# EAGLE design Side 2 (EAGLE 8.5.1)
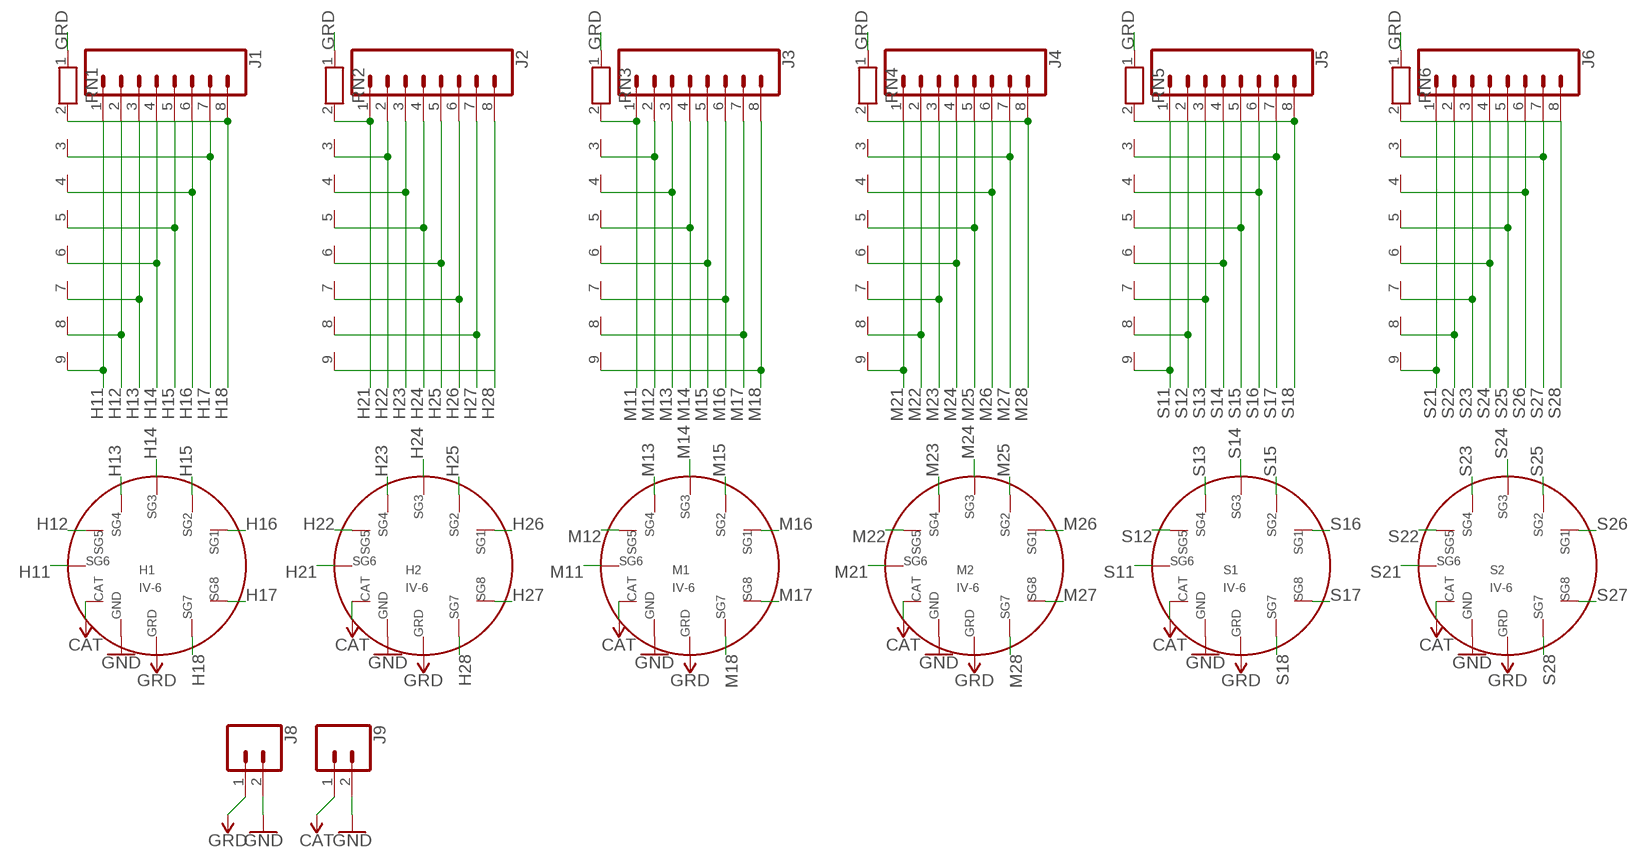
[diagram p0: schematic, sheet 1]

## Parts
H1  IV-6  [IV-6]
H2  IV-6  [IV-6]
J1  CONN_08"  [1X08]
J2  CONN_08"  [1X08]
J3  CONN_08"  [1X08]
J4  CONN_08"  [1X08]
J5  CONN_08"  [1X08]
J6  CONN_08"  [1X08]
J8  CONN_02  [1X02]
J9  CONN_02  [1X02]
M1  IV-6  [IV-6]
M2  IV-6  [IV-6]
RN1  RN08  [RN-9]
RN2  RN08  [RN-9]
RN3  RN08  [RN-9]
RN4  RN08  [RN-9]
RN5  RN08  [RN-9]
RN6  RN08  [RN-9]
S1  IV-6  [IV-6]
S2  IV-6  [IV-6]

## Nets
CAT: H1.CAT H2.CAT J9.1 M1.CAT M2.CAT S1.CAT S2.CAT
GND: H1.GND H2.GND J8.2 J9.2 M1.GND M2.GND S1.GND S2.GND
GRD: H1.GRD H2.GRD J8.1 M1.GRD M2.GRD RN1.1 RN2.1 RN3.1 RN4.1 RN5.1 RN6.1 S1.GRD S2.GRD
H11: H1.SG6 J1.1 RN1.9
H12: H1.SG5 J1.2 RN1.8
H13: H1.SG4 J1.3 RN1.7
H14: H1.SG3 J1.4 RN1.6
H15: H1.SG2 J1.5 RN1.5
H16: H1.SG1 J1.6 RN1.4
H17: H1.SG8 J1.7 RN1.3
H18: H1.SG7 J1.8 RN1.2
H21: H2.SG6 J2.1 RN2.2
H22: H2.SG5 J2.2 RN2.3
H23: H2.SG4 J2.3 RN2.4
H24: H2.SG3 J2.4 RN2.5
H25: H2.SG2 J2.5 RN2.6
H26: H2.SG1 J2.6 RN2.7
H27: H2.SG8 J2.7 RN2.8
H28: H2.SG7 J2.8 RN2.9
M11: J3.1 M1.SG6 RN3.2
M12: J3.2 M1.SG5 RN3.3
M13: J3.3 M1.SG4 RN3.4
M14: J3.4 M1.SG3 RN3.5
M15: J3.5 M1.SG2 RN3.6
M16: J3.6 M1.SG1 RN3.7
M17: J3.7 M1.SG8 RN3.8
M18: J3.8 M1.SG7 RN3.9
M21: J4.1 M2.SG6 RN4.9
M22: J4.2 M2.SG5 RN4.8
M23: J4.3 M2.SG4 RN4.7
M24: J4.4 M2.SG3 RN4.6
M25: J4.5 M2.SG2 RN4.5
M26: J4.6 M2.SG1 RN4.4
M27: J4.7 M2.SG8 RN4.3
M28: J4.8 M2.SG7 RN4.2
S11: J5.1 RN5.9 S1.SG6
S12: J5.2 RN5.8 S1.SG5
S13: J5.3 RN5.7 S1.SG4
S14: J5.4 RN5.6 S1.SG3
S15: J5.5 RN5.5 S1.SG2
S16: J5.6 RN5.4 S1.SG1
S17: J5.7 RN5.3 S1.SG8
S18: J5.8 RN5.2 S1.SG7
S21: J6.1 RN6.9 S2.SG6
S22: J6.2 RN6.8 S2.SG5
S23: J6.3 RN6.7 S2.SG4
S24: J6.4 RN6.6 S2.SG3
S25: J6.5 RN6.5 S2.SG2
S26: J6.6 RN6.4 S2.SG1
S27: J6.7 RN6.3 S2.SG8
S28: J6.8 RN6.2 S2.SG7

## Library data of the parts
H1 H2 M1 M2 S1 S2 = Clock components:IV-6
J1-J6 = SparkFun-Connectors:CONN_08: Multi connection point. Often used as Generic Header-pin footprint for 0.1 inch spaced/style header connections On any of the 0.1 inch spaced packages, you can populate with these: Break Away Headers - Straight <https://www.sparkfun.com/products/116> (PRT-00116) Break Away Male Headers - Right Angle <https://www.sparkfun.com/products/553> (PRT-00553) Female Headers <https://www.sparkfun.com/products/115> (PRT-00115) Break Away Headers - Machine Pin <https://www.sparkfun.com/products/117> (PRT-00117) Break Away Female Headers - Swiss Machine Pin <https://www.sparkfun.com/products/743> (PRT-00743) Arduino Stackable Header - 8 Pin <https://www.sparkfun.com/products/9279> (PRT-09279) For SCREWTERMINALS and SPRING TERMINALS visit here: Screw Terimnals on SparkFun.com <https://www.sparkfun.com/search/results?term=Screw+Terminals> (5mm/3.5mm/2.54mm spacing) This device is also useful as a general connection point to wire up your design to another part of your project. Our various solder wires solder well into these plated through hole pads. Hook-Up Wire - Assortment (Stranded, 22 AWG) <https://www.sparkfun.com/products/11375> (PRT-11375) Hook-Up Wire - Assortment (Solid Core, 22 AWG) <https://www.sparkfun.com/products/11367> (PRT-11367) View the entire wire category on our website here <https://www.sparkfun.com/categories/141> Special notes: Molex polarized connector foot print use with SKU : PRT-08231 with associated crimp pins and housings. 1MM SMD Version SKU: PRT-10208 NOTES ON THE VARIANTS LOCK and LOCK_LONGPADS... This footprint was designed to help hold the alignment of a through-hole component (i.e. 6-pin header) while soldering it into place. You may notice that each hole has been shifted either up or down by 0.005 of an inch from it's more standard position (which is a perfectly straight line). This slight alteration caused the pins (the squares in the middle) to touch the edges of the holes. Because they are alternating, it causes a "brace" to hold the component in place. 0.005 has proven to be the perfect amount of "off-center" position when using our standard breakaway headers. Although looks a little odd when you look at the bare footprint, once you have a header in there, the alteration is very hard to notice. Also,if you push a header all the way into place, it is covered up entirely on the bottom side.; PROD_ID: CONN-08438
J8 J9 = SparkFun-Connectors:CONN_02: Multi connection point. Often used as Generic Header-pin footprint for 0.1 inch spaced/style header connections On any of the 0.1 inch spaced packages, you can populate with these: Break Away Headers - Straight <https://www.sparkfun.com/products/116> (PRT-00116) Break Away Male Headers - Right Angle <https://www.sparkfun.com/products/553> (PRT-00553) Female Headers <https://www.sparkfun.com/products/115> (PRT-00115) Break Away Headers - Machine Pin <https://www.sparkfun.com/products/117> (PRT-00117) Break Away Female Headers - Swiss Machine Pin <https://www.sparkfun.com/products/743> (PRT-00743) For SCREWTERMINALS and SPRING TERMINALS visit here: Screw Terimnals on SparkFun.com <https://www.sparkfun.com/search/results?term=Screw+Terminals> (5mm/3.5mm/2.54mm spacing) This device is also useful as a general connection point to wire up your design to another part of your project. Our various solder wires solder well into these plated through hole pads. Hook-Up Wire - Assortment (Stranded, 22 AWG) <https://www.sparkfun.com/products/11375> (PRT-11375) Hook-Up Wire - Assortment (Solid Core, 22 AWG) <https://www.sparkfun.com/products/11367> (PRT-11367) View the entire wire category on our website here <https://www.sparkfun.com/categories/141> Special notes: Molex polarized connector foot print use with: PRT-08233 with associated crimp pins and housings. 2.54_SCREWTERM for use with PRT-10571. 3.5mm Screw Terminal footprints for PRT-08084 5mm Screw Terminal footprints for use with PRT-08432
RN1-RN6 = resistor-net:RN08: RESISTOR NETWORK; OC_FARNELL: unknown; OC_NEWARK: unknown

## Board
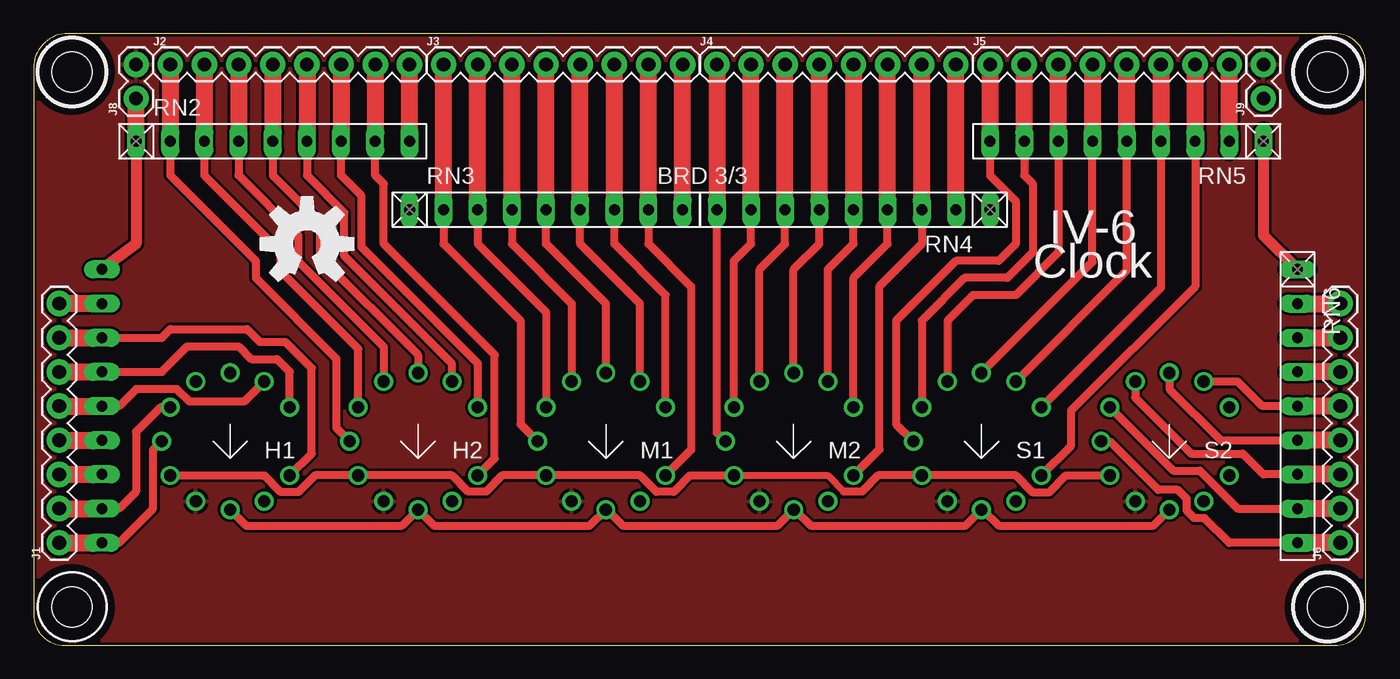
[diagram p1: board, top side]
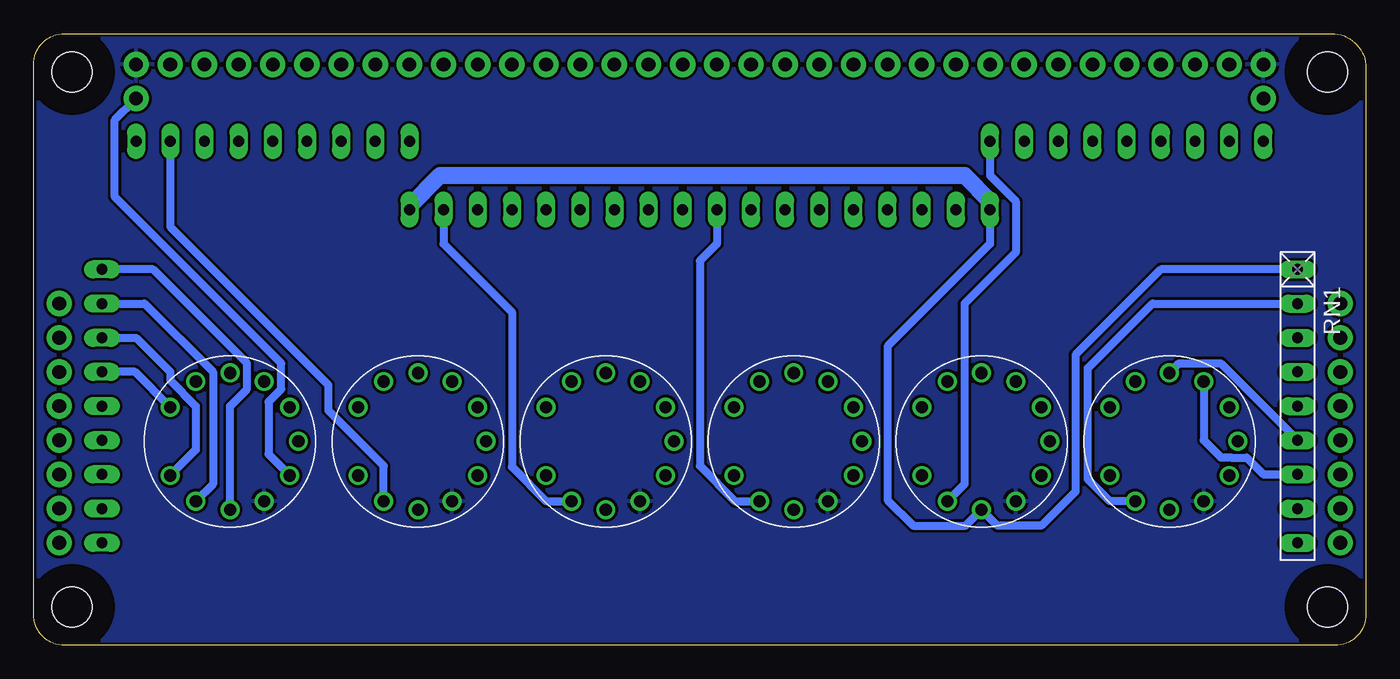
[diagram p2: board, bottom side, seen from below]

Size 99.06 x 45.47 mm. Coordinates in mm from the lower left corner, seen from the top.
Outline: 0,42.93 0,2.29 arc90 2.29,0 96.77,0 arc90 99.06,2.29 99.06,43.18 arc90 96.77,45.47 2.54,45.47 arc90 0,42.93
Copper layers (1*16): Top 0.035mm / dielectric 1.5mm / Bottom 0.035mm
Design rules "default *": minimum track width 6mil, minimum drill 0.35mm, track to track 8mil, track to pad 8mil, pad to pad 8mil, via to via 8mil, smd to smd 8mil, copper to edge 8mil, drill to drill 8mil, minimum pad ring 10mil, minimum via ring 8mil, stop-mask expansion 4mil, vias tented up to drill 0mil, thermal gap 10mil
Holes 3 mm at 2.86,42.61 96.2,42.61 96.2,2.86 2.86,2.86
tRestrict: area 1,1 to 4.8,4.8; area 1,40.7 to 4.8,44.5; area 94.3,40.7 to 98.1,44.5; area 94.3,1 to 98.1,4.8
bRestrict: area 1,1 to 4.8,4.8; area 1,40.7 to 4.8,44.5; area 94.3,40.7 to 98.1,44.5; area 94.3,1 to 98.1,4.8

### Footprints (pad centres in the part's own frame; a part is rotated, then mirrored left to right if it is on the bottom)
IV-6 = drill 0.9: CAT -4.445,-2.54; GND -2.54,-4.445; GRD 0,-5.08; SG1 4.445,2.54; SG2 2.54,4.445; SG3 0,5.08; SG4 -2.54,4.445; SG5 -4.445,2.54; SG6 -5.08,0; SG7 2.54,-4.445; SG8 4.445,-2.54
1X08 = drill 1.016 pad 1.88: 1 0,0; 2 2.54,0; 3 5.08,0; 4 7.62,0; 5 10.16,0; 6 12.7,0; 7 15.24,0; 8 17.78,0
1X02 = drill 1.016 pad 1.88: 1 0,0; 2 2.54,0
RN-9 = drill 0.813 long: 1 -10.16,0; 2 -7.62,0; 3 -5.08,0; 4 -2.54,0; 5 0,0; 6 2.54,0; 7 5.08,0; 8 7.62,0; 9 10.16,0

### Placement (x,y rotation side)
H1  14.61,15.16 0 top
H2  28.57,15.16 0 top
J1  1.91,7.62 90 top
J2  10.16,43.18 0 top
J3  30.48,43.18 0 top
J4  50.8,43.18 0 top
J5  71.12,43.18 0 top
J6  97.16,7.62 90 top
J8  7.62,40.64 90 top
J9  91.44,40.64 90 top
M1  42.55,15.16 0 top
M2  56.52,15.16 0 top
RN1  5.08,17.78 270 bottom
RN2  17.78,37.47 0 top
RN3  38.1,32.38 0 top
RN4  60.96,32.38 180 top
RN5  81.28,37.47 180 top
RN6  93.98,17.78 270 top
S1  70.48,15.16 0 top
S2  84.45,15.16 0 top
U$1  [OSHW-LOGO-L]  20.32,29.84 0 top

### Tracks (layer width: path | path; a pad name or v marks a point on that pad's centre or on a via)
CAT
  Top 0.508: M2.CAT 59.05,12.62 60.25,11.43
  Top 0.61: 60.25,11.43 61.59,11.43 62.79,12.62 S1.CAT 73.03,12.62 74.26,11.39 75.53,11.39 76.76,12.62 S2.CAT | H1.CAT 17.14,12.62 18.38,11.39 19.68,11.39 20.92,12.62 H2.CAT 31.11,12.62 32.31,11.43 33.66,11.43 34.85,12.62 M1.CAT 45.09,12.62 46.3,11.41 47.61,11.41 48.82,12.62 M2.CAT
  Bottom 0.61: S2.CAT 81.6,14.21 81.6,18.1 80.64,19.05 80.64,20.95 93.03,33.34 93.03,39.05 J9.1
GND
  pour Top: 0,0 0,45.4 99.06,45.4 99.06,0
  pour Bottom: 0,0 0,45.4 99.06,45.4 99.06,0
  pour Bottom (no thermals): 27.94,41.91 72.39,41.91 72.39,39.37 26.67,39.37 26.67,40.64
GRD
  Top 0.508: M1.GRD 42.62,10.08 | M2.GRD 56.59,10.08 | S1.GRD 70.56,10.08
  Top 0.61: H1.GRD 15.8,8.89 27.38,8.89 H2.GRD 29.77,8.89 41.35,8.89 M1.GRD | 42.62,10.08 43.81,8.89 55.32,8.89 M2.GRD | 56.59,10.08 57.78,8.89 69.29,8.89 S1.GRD | 70.56,10.08 71.75,8.89 83.26,8.89 S2.GRD
  Top 0.813: RN2.1 7.62,29.84 RN1.1 | RN5.1 91.44,30.48 RN6.1
  Top 1.27: RN2.1 J8.1
  Bottom 0.61: S2.GRD 84.45,17.78 83.19,19.05 83.19,20.95 90.17,27.94 RN6.1 | RN1.1 15.24,27.94 21.59,21.59 21.59,11.43 24.13,8.89 27.38,8.89 H2.GRD 29.77,8.89 33.66,8.89 35.56,10.79 35.56,22.23 27.94,29.84 RN3.1
  Bottom 1.27: RN3.1 27.94,33.02 29.84,34.92 68.82,34.92 71.12,32.62 RN4.1
H11
  Top 0.61: H1.SG6 8.89,14.53 8.89,10.16 6.35,7.62 RN1.9
  Top 1.27: J1.1 RN1.9
H12
  Top 0.61: H1.SG5 9.45,17.7 7.62,15.88 7.62,11.43 6.35,10.16 RN1.8
  Top 1.27: J1.2 RN1.8
H13
  Top 1.27: J1.3 RN1.7
  Bottom 0.61: RN1.7 7.62,12.7 8.87,13.95 10.03,13.95 10.04,13.97 10.79,13.97 12.06,15.24 H1.SG4
H14
  Top 1.27: J1.4 RN1.6
  Bottom 0.61: H1.SG3 13.89,20.95 10.79,20.95 RN1.6
H15
  Top 0.61: H1.SG2 15.65,18.11 11.59,18.11 10.65,19.05 7.62,19.05 6.35,17.78 RN1.5
  Top 1.27: J1.5 RN1.5
H16
  Top 0.61: RN1.4 9.53,20.32 11.43,22.23 15.24,22.23 16.19,21.27 18.1,21.27 19.05,20.32 H1.SG1
  Top 1.27: J1.6 RN1.4
H17
  Top 0.61: H1.SG8 20.68,14.25 20.68,20.6 18.73,22.54 16.83,22.54 15.88,23.5 10.16,23.5 9.53,22.86 RN1.3
  Top 1.27: J1.7 RN1.3
H18
  Top 1.27: RN1.2 J1.8
  Bottom 0.61: H1.SG7 19.05,10.72 20.68,12.34 20.68,20.6 15.88,25.4 RN1.2
H21
  Top 0.61: RN2.2 10.16,34.92 16.51,28.57 16.51,27.3 22.5,21.31 22.5,16.15 H2.SG6
  Top 1.27: J2.1 RN2.2
H22
  Top 0.61: H2.SG5 24.13,22.03 18.32,27.84 18.32,29.31 12.7,34.92 RN2.3
  Top 1.27: J2.2 RN2.3
H23
  Top 0.508: 19.68,28.57 19.67,28.56
  Top 0.61: H2.SG4 26.04,22.19 19.67,28.56 | RN2.4 15.24,34.92 19.68,30.48 19.68,28.57
  Top 1.27: J2.3 RN2.4
H24
  Top 0.61: RN2.5 17.78,34.92 21.27,31.43 21.27,28.89 28.57,21.59 H2.SG3
  Top 1.27: J2.4 RN2.5
H25
  Top 0.61: RN2.6 20.32,34.92 23.09,32.15 23.09,28.95 31.11,20.92 H2.SG2
  Top 1.27: J2.5 RN2.6
H26
  Top 0.61: RN2.7 22.86,34.92 24.38,33.4 24.38,29.59 33.02,20.95 H2.SG1
  Top 1.27: J2.6 RN2.7
H27
  Top 0.61: RN2.8 25.4,34.92 26.04,34.29 26.04,29.84 34.29,21.59 34.29,13.89 H2.SG8
  Top 1.27: J2.7 RN2.8
H28
  Top 1.27: RN2.9 J2.8
  Bottom 0.61: RN2.9 27.94,34.92 26.04,33.02 26.04,29.21 29.84,25.4 29.84,11.99 H2.SG7
M11
  Top 0.61: RN3.2 30.48,29.84 36.2,24.13 36.2,16.43 M1.SG6
  Top 1.27: RN3.2 J3.1
M12
  Top 0.61: RN3.3 33.02,29.84 38.1,24.77 M1.SG5
  Top 1.27: RN3.3 J3.2
M13
  Top 0.61: RN3.4 35.56,29.84 40.01,25.4 M1.SG4
  Top 1.27: RN3.4 J3.3
M14
  Top 0.61: M1.SG3 42.55,25.4 38.1,29.84 RN3.5
  Top 1.27: RN3.5 J3.4
M15
  Top 0.61: M1.SG2 45.09,25.4 40.64,29.84 RN3.6
  Top 1.27: RN3.6 J3.5
M16
  Top 0.61: M1.SG1 46.99,26.04 43.18,29.84 RN3.7
  Top 1.27: RN3.7 J3.6
M17
  Top 0.61: RN3.8 45.72,29.84 48.9,26.67 48.9,14.53 M1.SG8
  Top 1.27: RN3.8 J3.7
M18
  Top 1.27: RN3.9 J3.8
  Bottom 0.61: RN3.9 48.26,29.84 49.53,28.57 49.53,13.34 46.91,10.72 M1.SG7
M21
  Top 0.61: M2.SG6 50.8,15.8 RN4.9
  Top 1.27: J4.1 RN4.9
M22
  Top 0.61: M2.SG5 52.07,28.57 53.34,29.84 RN4.8
  Top 1.27: RN4.8 J4.2
M23
  Top 0.61: RN4.7 55.88,29.84 53.98,27.94 M2.SG4
  Top 1.27: RN4.7 J4.3
M24
  Top 0.61: RN4.6 58.42,29.84 56.52,27.94 M2.SG3
  Top 1.27: RN4.6 J4.4
M25
  Top 0.61: M2.SG2 59.05,27.94 60.96,29.84 RN4.5
  Top 1.27: J4.5 RN4.5
M26
  Top 0.61: RN4.4 63.5,29.84 60.96,27.3 M2.SG1
  Top 1.27: RN4.4 J4.6
M27
  Top 0.61: RN4.3 66.04,29.84 62.9,26.71 62.9,14.56 M2.SG8
  Top 1.27: RN4.3 J4.7
M28
  Top 1.27: RN4.2 J4.8
  Bottom 0.61: M2.SG7 60.96,10.72 63.5,13.26 63.5,24.77 68.58,29.84 RN4.2
S11
  Top 0.508: S1.SG6
  Top 0.61: RN5.9 71.12,34.92 73.03,33.02 73.03,29.84 71.75,28.57 68.58,28.57 64.14,24.13 64.14,16.44 S1.SG6
  Top 1.27: J5.1 RN5.9
S12
  Top 0.61: RN5.8 73.66,34.92 74.3,34.29 74.3,29.21 72.39,27.3 69.22,27.3 66.04,24.13 S1.SG5
  Top 1.27: RN5.8 J5.2
S13
  Top 0.61: RN5.7 76.2,29.21 73.03,26.04 69.85,26.04 67.94,24.13 S1.SG4
  Top 1.27: RN5.7 J5.3
S14
  Top 0.61: RN5.6 78.74,28.5 S1.SG3
  Top 1.27: J5.4 RN5.6
S15
  Top 0.61: S1.SG2 81.28,27.86 RN5.5
  Top 1.27: RN5.5 J5.5
S16
  Top 0.61: RN5.4 83.82,26.59 S1.SG1
  Top 1.27: J5.6 RN5.4
S17
  Top 0.508: S1.SG8 74.95,12.63
  Top 0.61: RN5.3 86.36,26.67 77.15,17.46 77.15,14.85 S1.SG8
  Top 1.27: RN5.3 J5.7
S18
  Top 1.27: RN5.2 J5.8
  Bottom 0.61: S1.SG7 73.03,13.34 77.15,17.46 77.15,19.37 88.9,31.11 RN5.2
S21
  Top 0.508: S2.SG6 80.01,15.16
  Top 0.61: RN6.9 88.9,7.62 87.06,9.46 86.29,9.46 85.72,10.03 85.72,10.93 85.09,11.56 83.61,11.56 80.01,15.16
  Top 1.27: J6.1 RN6.9
S22
  Top 0.61: RN6.8 89.53,10.16 86.72,12.98 84.73,12.98 S2.SG5
  Top 1.27: J6.2 RN6.8
S23
  Top 0.61: RN6.7 91.44,12.7 89.89,14.25 86.08,14.25 81.92,18.41 S2.SG4
  Top 1.27: J6.3 RN6.7
S24
  Top 0.61: S2.SG3 84.45,19.05 88.27,15.24 RN6.6
  Top 1.27: J6.4 RN6.6
S25
  Top 0.61: S2.SG2 89.53,19.61 91.36,17.78 RN6.5
  Top 1.27: J6.5 RN6.5
S26
  Top 1.27: J6.6 RN6.4
  Bottom 0.61: S2.SG1 91.52,20.32 RN6.4
S27
  Top 1.27: RN6.3 J6.7
  Bottom 0.61: RN6.3 91.44,22.86 88.9,20.32 88.9,19.68 87,17.78 87,14.53 S2.SG8
S28
  Top 1.27: RN6.2 J6.8
  Bottom 0.61: RN6.2 90.81,25.4 85.72,20.32 85.72,11.99 S2.SG7

### Text on the board
tNames: BRD 3/3 | IV-6 / Clock
bRestrict: IV-6_Clock ¤ BRD 3/3 ¤ @SilasAlroe